# Altium project 2019_ESP01_Prog.PrjPcb
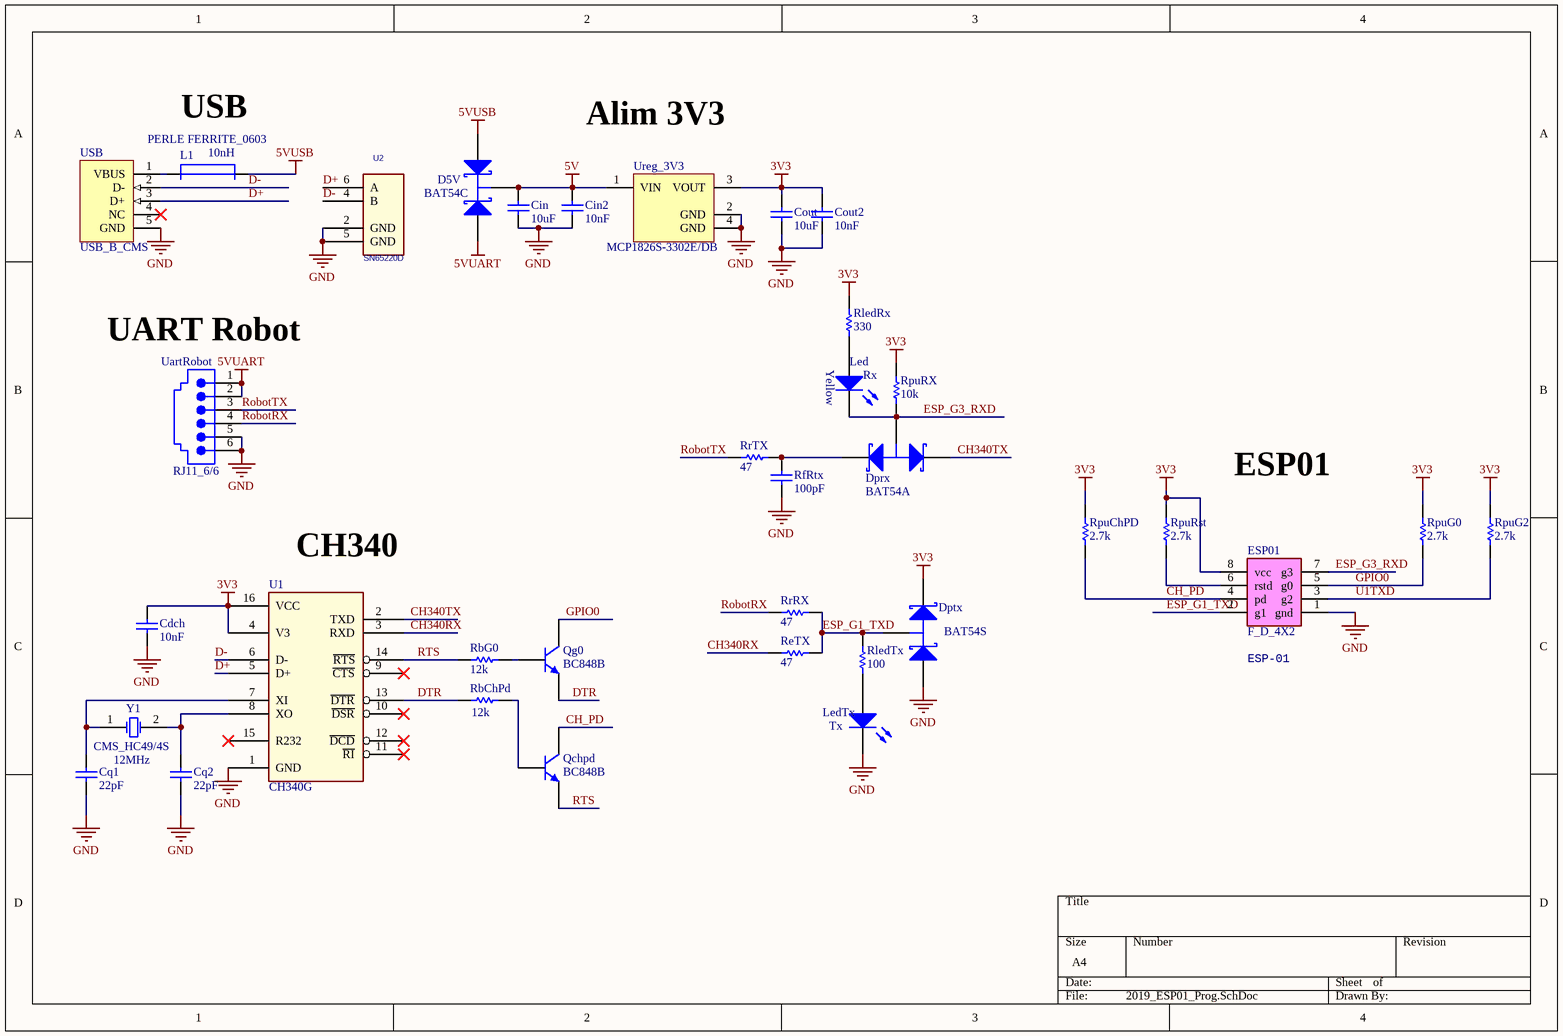
[diagram p0: 2019_ESP01_Prog.SchDoc]
1 sheet, 35 parts. Net scope: global (net labels, ports and power ports of the same name join across sheets).
Board file: 2019_ESP01_Prog.PcbDoc

## Sheet 2019_ESP01_Prog.SchDoc
size A4

### Parts
Cdch  10nF  [C0805_N]
Cin  10uF  [C1206_N]
Cin2  10nF  [C0805_N]
Cout  10uF  [C1206_N]
Cout2  10nF  [C0805_N]
Cq1  22pF  [C0805_N]
Cq2  22pF  [C0805_N]
D5V  BAT54C  [SOT23-3N]
Dprx  BAT54A  [SOT23-3N]
Dptx  BAT54S  [SOT23-3N]
ESP01  Type: F_D_4X2  [ESP01]  (hidden comment: BARRETTE_4 CONTACTS_2 RANGEES_FEMELLE_DROITE)
L1  value 10nH  Type: PERLE FERRITE_0603  [INDUCTANCE_CMS_0603]  (hidden comment: INDUCTANCE_PERLE_DE_FERRITE_0603)
Led  Rx  [LED_0805]
LedTx  Tx  [LED_0805]
Qchpd  BC848B  [SOT23-3N]
Qg0  BC848B  [SOT23-3N]
RbChPd  12k  [R1206_N]
RbG0  12k  [R1206_N]
ReTX  47  [R1206_N]
RfRtx  100pF  [C0805_N]
RledRx  330  [R1206_N]
RledTx  100  [R1206_N]
RpuChPD  2.7k  [R1206_N]
RpuG0  2.7k  [R1206_N]
RpuG2  2.7k  [R1206_N]
RpuRst  2.7k  [R1206_N]
RpuRX  10k  [R1206_N]
RrRX  47  [R1206_N]
RrTX  47  [R1206_N]
U1  CH340G  [SO16_N]
U2  SN65220D  [SOT26_PAS=0.95_LARG=3_LONG=3]
UartRobot  RJ11_6/6  [RJ11_6/6 - Wurth Half Shielded Tab Down WR-MJ]
Ureg_3V3  MCP1826S-3302E/DB  [SOT223-4N]
USB  USB_B_CMS  [USB_MINI_B]
Y1  value 12MHz  Type: CMS_HC49/4S  [QUARTZ_CMS_HC49/4S]  (hidden comment: QUARTZ_CMS_HC49/4S)

### Nets
3V3: Cdch.2 Cout.2 Cout2.2 Dptx.2(K) ESP01.8(vcc) RledRx.1 RpuChPD.2 RpuG0.2 RpuG2.2 RpuRst.2 RpuRX.2 U1.4(V3) U1.16(VCC) Ureg_3V3.3(VOUT)
5V: Cin.2 Cin2.2 D5V.3(K) Ureg_3V3.1(VIN)
5VUART: D5V.2(A2) UartRobot.1 UartRobot.2
5VUSB: D5V.1(A1) L1.2
GND: Cdch.1 Cin.1 Cin2.1 Cout.1 Cout2.1 Cq1.1 Cq2.1 Dptx.1(A) ESP01.1(gnd) LedTx.2(K) RfRtx.1 U1.1(GND) U2.2(GND) U2.5(GND) UartRobot.5 UartRobot.6 Ureg_3V3.2(GND) Ureg_3V3.4(GND) USB.5(GND)
CH340RX: ReTX.1 U1.3(RXD)
CH340TX: Dprx.1(K1) U1.2(TXD)
CH_PD: ESP01.4(pd) Qchpd.3(C) RpuChPD.1
D+: U1.5(D+) U2.6(A) USB.3(D+)
D-: U1.6(D-) U2.4(B) USB.2(D-)
DTR: Qg0.2(E) RbChPd.2 U1.13(~{DTR})
ESP_G1_TXD: Dptx.3(C) ESP01.2(g1) ReTX.2 RledTx.1 RrRX.2
ESP_G3_RXD: Dprx.3(A) ESP01.7(g3) Led.2(K) RpuRX.1
GPIO0: ESP01.5(g0) Qg0.3(C) RpuG0.1
RobotRX: RrRX.1 UartRobot.4
RobotTX: RrTX.1 UartRobot.3
RTS: Qchpd.2(E) RbG0.2 U1.14(~{RTS})
U1TXD: ESP01.3(g2) RpuG2.1
NetCq1_2: Cq1.2 U1.7(XI) Y1.1(OSC1)
NetCq2_2: Cq2.2 U1.8(XO) Y1.2(OSC2)
NetDprx_2: Dprx.2(K2) RfRtx.2 RrTX.2
NetESP01_6: ESP01.6(rstd) RpuRst.1
NetL1_1: L1.1 USB.1(VBUS)
NetLed_1: Led.1(A) RledRx.2
NetLedTx_1: LedTx.1(A) RledTx.2
NetQchpd_1: Qchpd.1(B) RbChPd.1
NetQg0_1: Qg0.1(B) RbG0.1

Not connected (* = marked no-connect by the designer): U1 9(~{CTS})* 10(~{DSR})* 11(~{RI})* 12(~{DCD})* 15(R232)*; USB 4(NC)*

### Notes on the sheet
- USB
- Alim 3V3
- (near UartRobot) UART Robot
- (near Led) Yellow
- ESP01
- (near U1) CH340
- (near ESP01) ESP-01

### Library data of the parts
Cdch Cin Cin2 Cout Cout2 Cq1 Cq2 = Capacitor: Published: 8-Jun-2000; LatestRevisionDate: 17-Jul-2002; LatestRevisionNote: Re-released for DXP Platform.; PackageReference: RAD-0.3; Publisher: Altium Limited
D5V = Diode Shottky double BAT54C: DIODE SCHOTTKY DOUBLE; Manufacturer: ZETEX; Diode Case Style: SOT-23; Supplier Part Number: 9526501; Supplier: Farnell; ComponentLink1URL: http://www.farnell.com/datasheets/27632.pdf; ComponentLink1Description: http://www.farnell.com/datasheets/27632.pdf; Pricing: 5=0,32, 25=0,23, 100=0,198, 1000=0,154 (EUR); RoHS: YES; Manufacturer Part Number: BAT54C
Dprx = Diode Shottky double  BAT54A: DIODE SCHOTTKY DOUBLE; Manufacturer: ZETEX; ComponentLink1URL: http://www.farnell.com/datasheets/27632.pdf; ComponentLink1Description: http://www.farnell.com/datasheets/27632.pdf; Supplier Part Number: 9526498; Supplier: Farnell; RoHS: YES; Manufacturer Part Number: BAT54A
Dptx = Diode Shottky double BAT54S: DIODE SCHOTTKY DOUBLE; Manufacturer: ZETEX; ComponentLink1URL: http://www.farnell.com/datasheets/27632.pdf; ComponentLink1Description: http://www.farnell.com/datasheets/27632.pdf; Supplier: Farnell; RoHS: YES; Supplier Part Number: 9526510; Pricing: 5=0,32, 25=0,26, 100=0,21, 1000=0,17 (EUR); Manufacturer Part Number: BAT54S
ESP01 = BARRETTE_4 CONTACTS_2 RANGEES_FEMELLE_DROITEE: BARRETTE 4 CONTACTS 2 RANGEES FEMELLE DROITE
L1 = INDUCTANCE_PERLE_DE_FERRITE_0603: INDUCTANCE PERLE DE FERRITE_0603
Led LedTx = LED: Typical LED; Published: 8-Jun-2000; LatestRevisionDate: 08-Jul-2005; LatestRevisionNote: Mech Layer 1 removed.; PackageReference: LED-1; Publisher: Altium Limited
Qchpd Qg0 = BC848B: NPN General-purpose Transistor; Published: 17-Sep-2003; LatestRevisionDate: 12-Dec-2006; LatestRevisionNote: IPC-7351 Footprint Added.; DatasheetVersion: 4-Feb-2002; PackageVersion: May-1999; PackageReference: SOT23; Publisher: Altium Limited; PackageDescription: 3-Pin SOT-23 Package 0.95 mm Pitch, 2.3 mm Lead Span; ComponentLink1Description: Manufacturer Link; ComponentLink1URL: http://www.semiconductors.philips.com/; ComponentLink2Description: Datasheet; ComponentLink2URL: http://www.semiconductors.philips.com/acrobat/datasheets/BC846_BC847_BC848_5.pdf
RbChPd RbG0 ReTX RledRx RledTx RpuChPD RpuG0 RpuG2 RpuRst RpuRX RrRX RrTX = Resistor: Published: 8-Jun-2000; LatestRevisionDate: 17-Jul-2002; LatestRevisionNote: Re-released for DXP Platform.; PackageReference: AXIAL-0.5; Publisher: Altium Limited
RfRtx = Condensateur: Capacitor; Published: 8-Jun-2000; LatestRevisionDate: 17-Jul-2002; LatestRevisionNote: Re-released for DXP Platform.; PackageReference: RAD-0.3; Publisher: Altium Limited
UartRobot = RJ11_6/6: Right Angle, Standard Profile, Offset Latch DECconnect, Flangeless PCB Jack; Ports: 1; Positions/Loaded: Port1 - 6 Offset Latch/6; PerformanceCategory: 3; PCB_Mounting: Thru-Hole; DrillSize: Nominal, Rounded to nearest 0.05mm; PCB_Layout: Complies with Manufacturer's Recommendation.; Published: 25-Jun-2002; DatasheetDocument: 18-Dec-2001; PackageDocument: 18-Dec-2001; PackageReference: 15-43-6110; Publisher: Altium Limited; ComponentLink1Description: Manufacturer Link; ComponentLink1URL: http://www.molex.com/; ComponentLink2Description: Datasheet; ComponentLink2URL: http://www.molex.com/cmc_upload/common_files/1212003_41369catalogpage.pdf; Type: RJ11_6/6
Ureg_3V3 = MCP1826S-3302E/DB: 1000 mA, Low Voltage, Low Quiescent Current LDO Regulator, 3-Pin SOT-223, Extended Temperature; FirstPublished: 29-Jan-2009; DatasheetVersion: revA, Aug-2007; PackageVersion: revBB, Aug-2009; PackageReference: SOT-223-DB3; Publisher: Altium Limited; PackageDescription: 3-Lead Plastic Small Outline Transistor (DB) [SOT-223]; Supplier 1: Digi-Key; Supplier Part Number 1: MCP1826S-3302E/DB-ND; Supplier 2: Farnell; Supplier Part Number 2: 1578424; Supplier 3: Newark; Supplier Part Number 3: 27M0037; ComponentLink1Description: Datasheet; ComponentLink1URL: http://ww1.microchip.com/downloads/en/DeviceDoc/22057a.pdf; ComponentLink2Description: Packaging Specification; ComponentLink2URL: http://www.microchip.com/stellent/groups/techpub_sg/documents/packagingspec/en012702.pdf; ComponentLink3Description: Microchip.com Home; ComponentLink3URL: http://www.microchip.com/
USB = USB_B_CMS: EMBASE USB CMS TYPE B; Type: USB_B_CMS
Y1 = QUARTZ_CMS_HC49/4S: QUARTZ CMS HC49/4S